# Altium schematic sheet M2梅花焊盘_2025-10-07.schdoc
size 37 x 24 mm
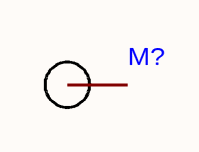
[diagram p0: M2梅花焊盘_2025-10-07.schdoc]

## Parts
M?  (no value)  [M2梅花焊盘]

## Nets

Not connected (* = marked no-connect by the designer): M? 1

## Library data of the parts
M? = M2梅花焊盘